# EAGLE design FAN-zero25-SHIM (EAGLE 9.6.2)
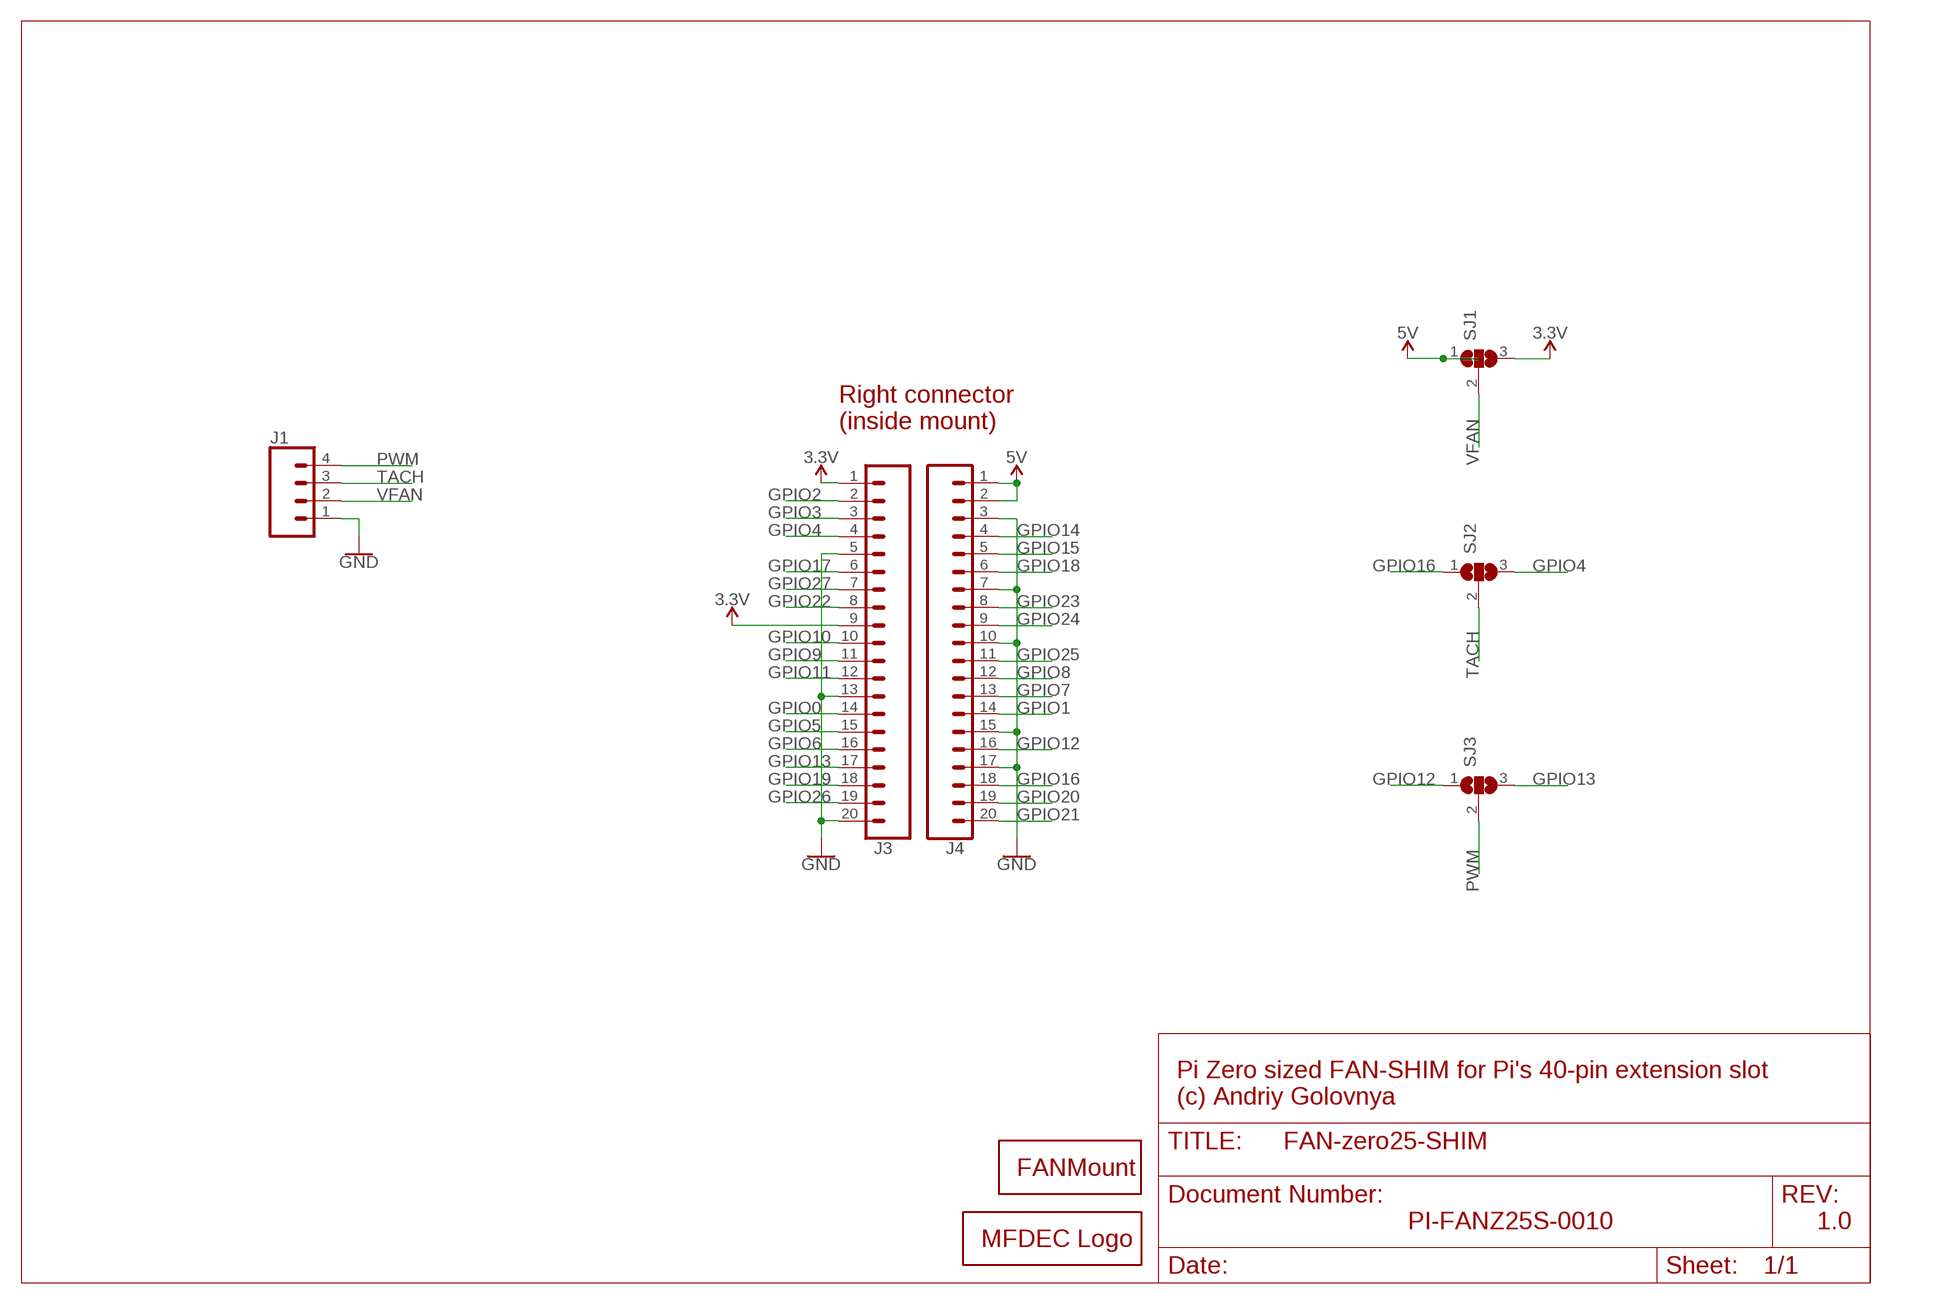
[diagram p0: schematic, sheet 1]

## Parts
FAN1  FAN25HO  [FAN25HO]
J1  CONN_04  [1X04]
J3  CONN_20LOCK  [1X20_LOCK]
J4  CONN_20LOCK  [1X20_LOCK]
LOGO1  MFDECLOGO_L_30MM  [MFDEC_L_30MM]
SJ1  SJ2  [SJ_2]
SJ2  SJ2  [SJ_2]
SJ3  SJ2  [SJ_2]

## Nets
3.3V: J3.1 J3.9 SJ1.3
5V: J4.1 J4.2 SJ1.1
GND: J1.1 J3.5 J3.13 J3.20 J4.3 J4.7 J4.10 J4.15 J4.17
GPIO0: J3.14
GPIO1: J4.14
GPIO2: J3.2
GPIO3: J3.3
GPIO4: J3.4 SJ2.3
GPIO5: J3.15
GPIO6: J3.16
GPIO7: J4.13
GPIO8: J4.12
GPIO9: J3.11
GPIO10: J3.10
GPIO11: J3.12
GPIO12: J4.16 SJ3.1
GPIO13: J3.17 SJ3.3
GPIO14: J4.4
GPIO15: J4.5
GPIO16: J4.18 SJ2.1
GPIO17: J3.6
GPIO18: J4.6
GPIO19: J3.18
GPIO20: J4.19
GPIO21: J4.20
GPIO22: J3.8
GPIO23: J4.8
GPIO24: J4.9
GPIO25: J4.11
GPIO26: J3.19
GPIO27: J3.7
PWM: J1.4 SJ3.2
TACH: J1.3 SJ2.2
VFAN: J1.2 SJ1.2

## Notes on the sheet
- Right connector
  (inside mount)
- Pi Zero sized FAN-SHIM for Pi's 40-pin extension slot
  (c) Andriy Golovnya
- PI-FANZ25S-0010 | 1.0

## Library data of the parts
FAN1 = _my_fans:FAN: Fan mount holes: 17mm 20mm 25mm 30mm 40mm 50mm 60mm
J1 = SparkFun-Connectors:CONN_04: Multi connection point. Often used as Generic Header-pin footprint for 0.1 inch spaced/style header connections On any of the 0.1 inch spaced packages, you can populate with these: Break Away Headers - Straight <https://www.sparkfun.com/products/116> (PRT-00116) Break Away Male Headers - Right Angle <https://www.sparkfun.com/products/553> (PRT-00553) Female Headers <https://www.sparkfun.com/products/115> (PRT-00115) Break Away Headers - Machine Pin <https://www.sparkfun.com/products/117> (PRT-00117) Break Away Female Headers - Swiss Machine Pin <https://www.sparkfun.com/products/743> (PRT-00743) For SCREWTERMINALS and SPRING TERMINALS visit here: Screw Terimnals on SparkFun.com <https://www.sparkfun.com/search/results?term=Screw+Terminals> (5mm/3.5mm/2.54mm spacing) This device is also useful as a general connection point to wire up your design to another part of your project. Our various solder wires solder well into these plated through hole pads. Hook-Up Wire - Assortment (Stranded, 22 AWG) <https://www.sparkfun.com/products/11375> (PRT-11375) Hook-Up Wire - Assortment (Solid Core, 22 AWG) <https://www.sparkfun.com/products/11367> (PRT-11367) View the entire wire category on our website here <https://www.sparkfun.com/categories/141> Special notes: Molex polarized connector foot print use with SKU : PRT-08231 with associated crimp pins and housings. 1MM SMD Version SKU: PRT-10208; PROD_ID: CONN-09696
J3 J4 = _my_locked_connectors:CONN_20: Multi connection point. Often used as Generic Header-pin footprint for 0.1 inch spaced/style header connections On any of the 0.1 inch spaced packages, you can populate with these: Break Away Headers - Straight <https://www.sparkfun.com/products/116> (PRT-00116) Break Away Male Headers - Right Angle <https://www.sparkfun.com/products/553> (PRT-00553) Female Headers <https://www.sparkfun.com/products/115> (PRT-00115) Break Away Headers - Machine Pin <https://www.sparkfun.com/products/117> (PRT-00117) Break Away Female Headers - Swiss Machine Pin <https://www.sparkfun.com/products/743> (PRT-00743) For SCREWTERMINALS and SPRING TERMINALS visit here: Screw Terimnals on SparkFun.com <https://www.sparkfun.com/search/results?term=Screw+Terminals> (5mm/3.5mm/2.54mm spacing) This device is also useful as a general connection point to wire up your design to another part of your project. Our various solder wires solder well into these plated through hole pads. Hook-Up Wire - Assortment (Stranded, 22 AWG) <https://www.sparkfun.com/products/11375> (PRT-11375) Hook-Up Wire - Assortment (Solid Core, 22 AWG) <https://www.sparkfun.com/products/11367> (PRT-11367) View the entire wire category on our website here <https://www.sparkfun.com/categories/141> Special notes: Molex polarized connector foot print use with SKU : PRT-08231 with associated crimp pins and housings. 1MM SMD Version SKU: PRT-10208 NOTES ON THE VARIANTS LOCK and LOCK_LONGPADS... This footprint was designed to help hold the alignment of a through-hole component (i.e. 6-pin header) while soldering it into place. You may notice that each hole has been shifted either up or down by 0.005 of an inch from it's more standard position (which is a perfectly straight line). This slight alteration caused the pins (the squares in the middle) to touch the edges of the holes. Because they are alternating, it causes a "brace" to hold the component in place. 0.005 has proven to be the perfect amount of "off-center" position when using our standard breakaway headers. Although looks a little odd when you look at the bare footprint, once you have a header in there, the alteration is very hard to notice. Also,if you push a header all the way into place, it is covered up entirely on the bottom side. Note about LOCK SPECIAL package: This is just like the LOCK variant in that the holes are staggared by 5 mil, but except for the last two holes. They are not altered from the "standard" footprint layout. This is used for a special purpose on the layout of our Graphic LCD Backpack. Make sure you want to use this device before selecting it for you project!
LOGO1 = _my_logos:MFDECLOGO: Midnight Fog - Digital Eye Candy LOGO
SJ1-SJ3 = _my_jumpers:SJ2: SMD solder JUMPER SJ2 - simple jumper SJ2FI - fancy inside jumper SJ2FO - fancy outside jumper SJ2FL - fancy left jumper SJ2FR - fancy right jumper SJ2W - wide jumper

## Board
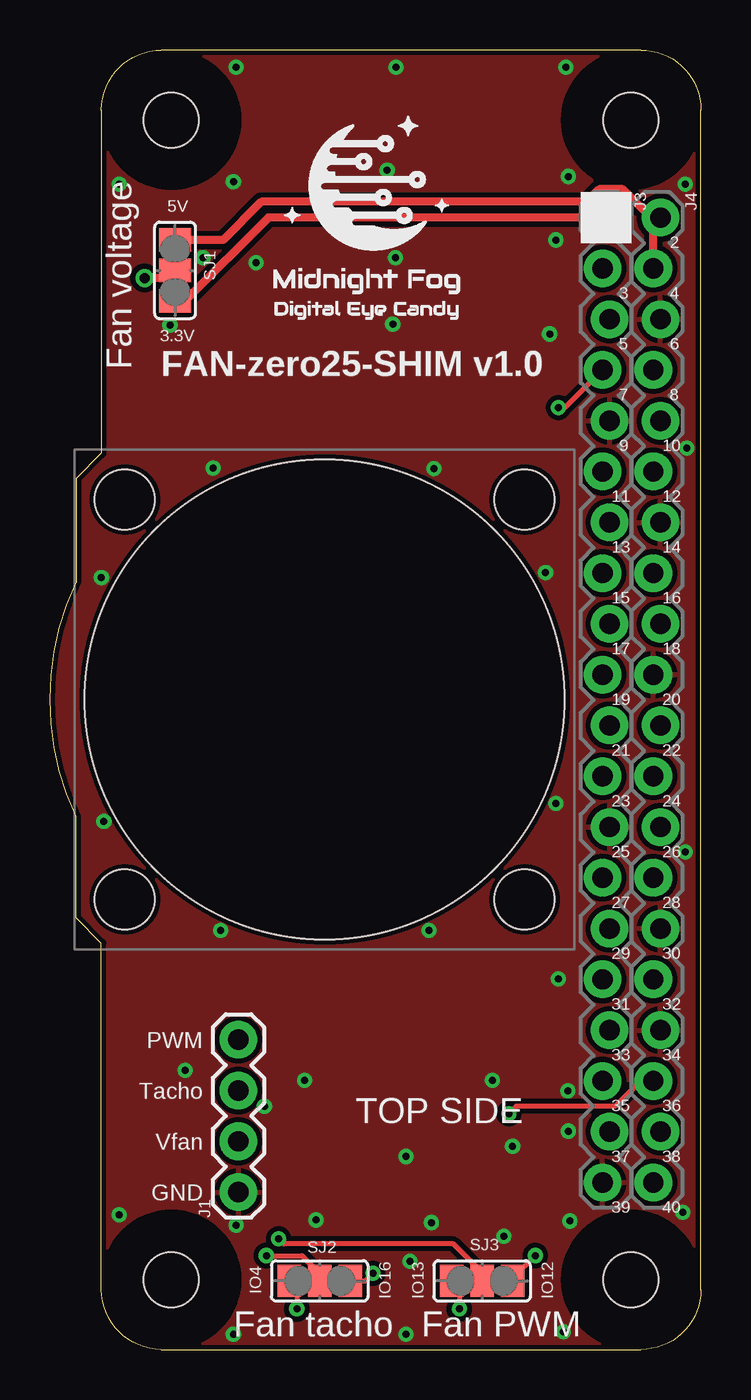
[diagram p1: board, top side]
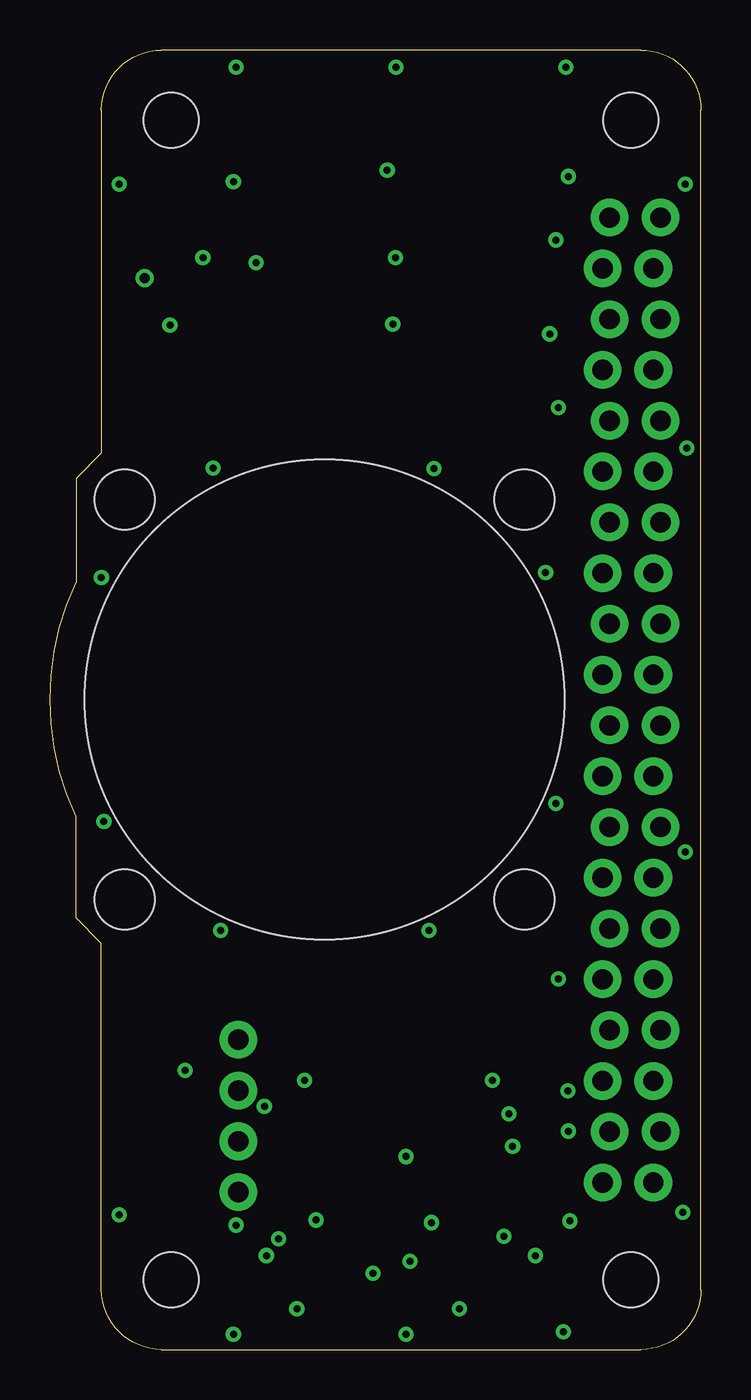
[diagram p2: board, inner layer Route2]
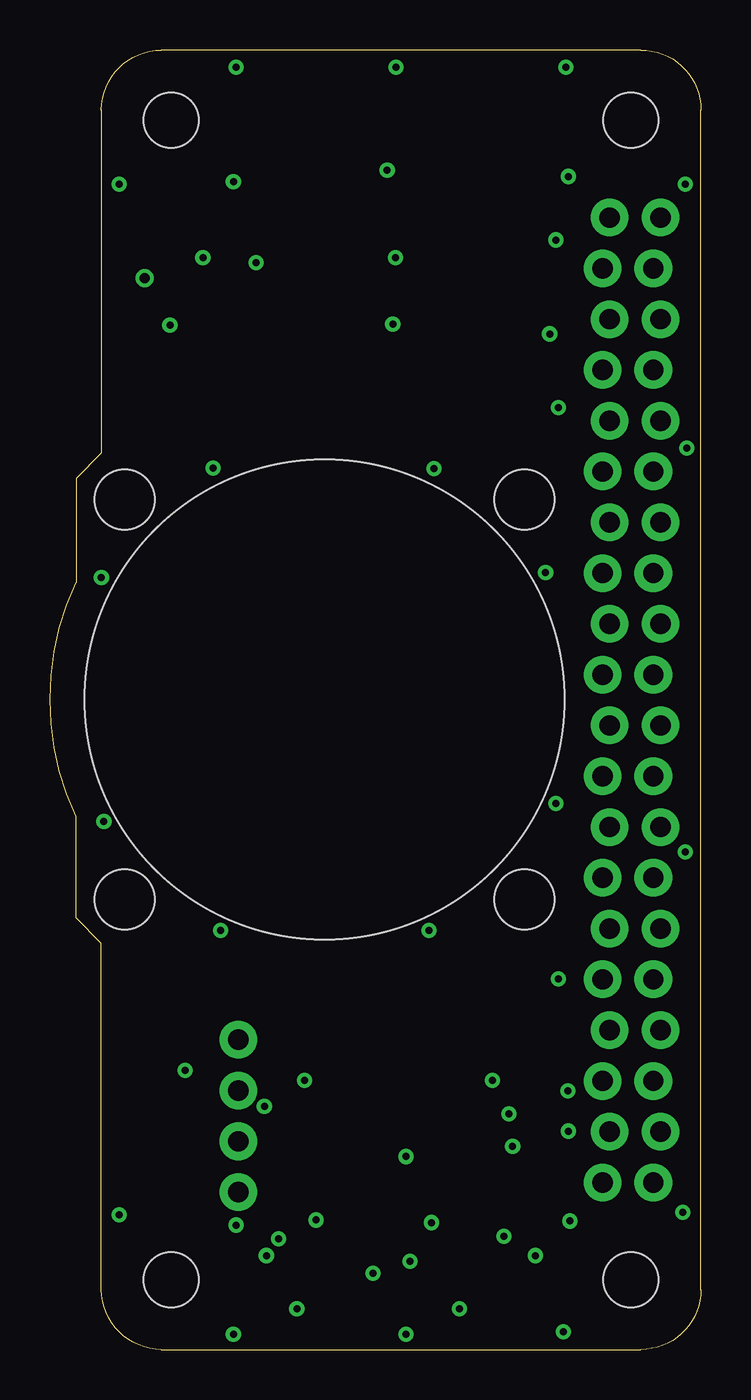
[diagram p3: board, inner layer Route15]
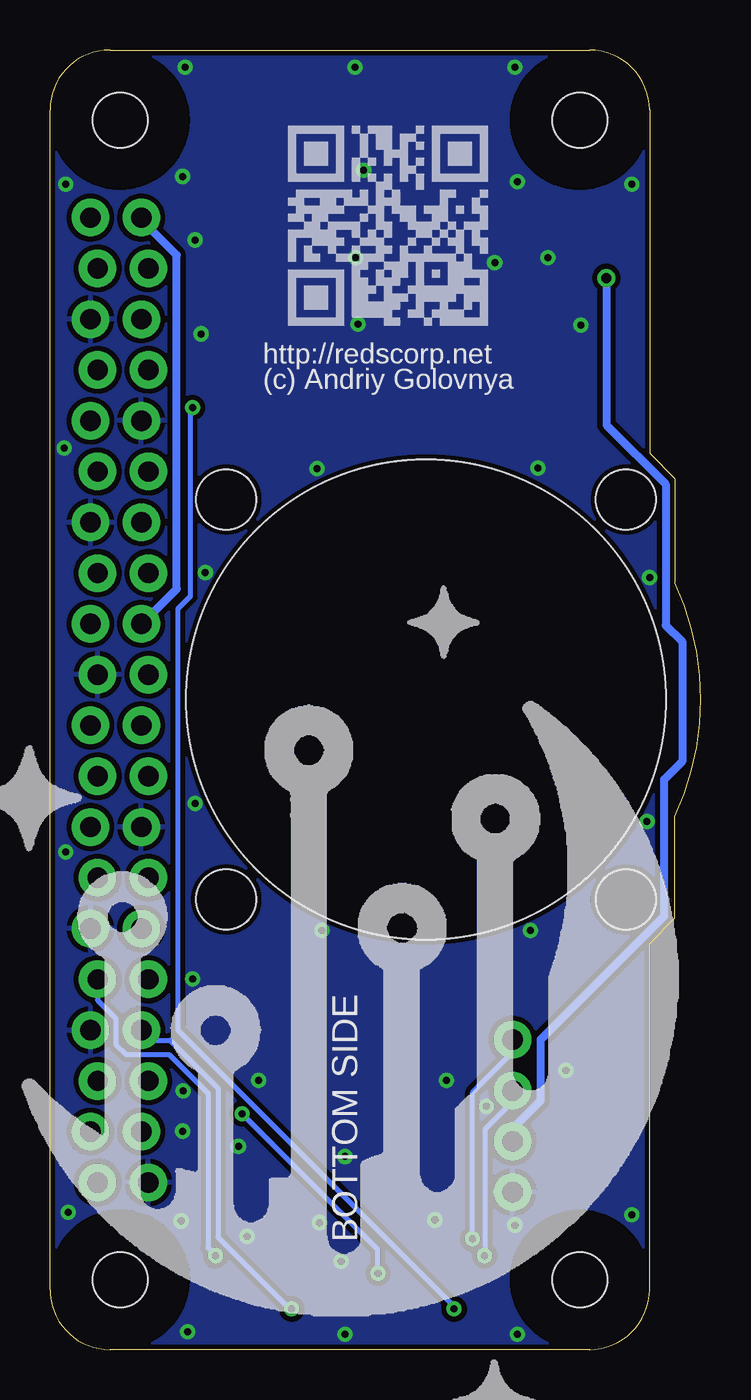
[diagram p4: board, bottom side, seen from below]

Size 32.57 x 65 mm. Coordinates in mm from the lower left corner, seen from the top.
Outline: 2.57,3 arc90 5.57,0 29.57,0 arc90 32.57,3 32.57,62 arc90 29.57,65 5.57,65 arc90 2.57,62
Outline: 2.57,3 arc0 2.57,3
Outline: 2.57,62 arc0 2.57,62
Outline: 2.57,3 2.57,20.32 1.3,21.59 1.3,26.67 arc-50 1.3,38.35 1.3,43.56 2.57,44.83 2.57,62
Copper layers (1*16): Top 0.035mm / dielectric 1.5mm / Bottom 0.035mm
Design rules "default *": minimum track width 6mil, minimum drill 0.35mm, track to track 6mil, track to pad 6mil, pad to pad 6mil, via to via 6mil, smd to smd 6mil, copper to edge 6mil, drill to drill 6mil, minimum pad ring 10mil, minimum via ring 8mil, stop-mask expansion 4mil, vias tented up to drill 20mil, thermal gap 10mil
Holes 2.75 mm at 6.07,3.5 29.07,3.5 6.07,61.5 29.07,61.5

### Footprints (pad centres in the part's own frame; a part is rotated, then mirrored left to right if it is on the bottom)
FAN25HO = hole 3: -10,10; 10,10; -10,-10; 10,-10 | hole 24: 0,0
1X04 = drill 1.016 pad 1.88: 1 0,0; 2 2.54,0; 3 5.08,0; 4 7.62,0
1X20_LOCK = drill 1.016 pad 1.88: 1 0,0.178; 2 2.54,-0.178; 3 5.08,0.178; 4 7.62,-0.178; 5 10.16,0.178; 6 12.7,-0.178; 7 15.24,0.178; 8 17.78,-0.178; 9 20.32,0.178; 10 22.86,-0.178; 11 25.4,0.178; 12 27.94,-0.178; 13 30.48,0.178; 14 33.02,-0.178; 15 35.56,0.178; 16 38.1,-0.178; 17 40.64,0.178; 18 43.18,-0.178; 19 45.72,0.178; 20 48.26,-0.178
SJ_2 = smd 1.168 x 1.6: 1 -1.524,0; 2 0,0; 3 1.524,0

### Placement (x,y rotation side)
FAN1  13.75,32.51 0 top
J1  9.43,7.87 90 top
J3  27.83,56.62 270 top
J4  30.37,56.62 270 top
LOGO1  -1.62,-7.11 90 bottom  (outside the outline)
LOGO2  MFDECLOGO_SQ_8MM  [MFDEC_SQ_8MM]  10.5,51.21 0 top
LOGO3  RSNURL_QR_10MM  [RSNURL_QR_10MM]  20.66,51.21 0 bottom
SJ1  6.26,53.98 270 top
SJ2  13.49,3.43 180 top
SJ3  21.62,3.43 180 top

### Tracks (layer width: path | path; a pad name or v marks a point on that pad's centre or on a via)
3.3V
  Top 0.406: J3.1 10.93,56.62 6.76,52.45 SJ1.3
  Bottom 0.406: J3.1 28,56.52 26.23,54.74 26.23,38.04 27.98,36.3 J3.9
5V
  Top 0.406: J4.2 30.19,56.26 J4.1 30.09,56.62 28.67,58.04 27.47,58.04 26.83,57.4 10.57,57.4 8.67,55.5 SJ1.1
GND  (via drill 0.35)
  other vias: 25.69,0.89 31.66,6.86 9.18,0.76 3.46,6.73 9.3,6.22 13.32,6.48 18.02,4.42 23.15,10.16 19.08,6.35 12.73,13.46 17.81,9.65 8.54,20.95 18.96,20.95 25.31,27.3 25.43,18.54 22.13,13.46 6.76,13.97 3.46,58.29 9.3,64.14 25.81,64.14 31.78,58.29 17.3,64.14 25.94,58.67 25.31,55.5 7.65,54.61 9.18,58.42 10.32,54.36 24.8,38.86 19.21,44.07 8.16,44.09 31.86,45.09 31.78,24.89 10.73,12.17 17.81,0.76 25.92,12.93 25.94,10.92 16.87,58.98 17.28,54.61 25,50.8 17.15,51.28 6,51.23 22.72,5.66 26.02,6.43 2.57,38.61 2.7,26.42
  pour Top (isolate 0.254): -6.32,0 -6.32,65.15 32.8,65.15 32.8,0
  pour Bottom (isolate 0.254): -6.32,0 -6.32,65.15 32.8,65.15 32.8,0
GND1
  cutout Top: 29.07,0 arc-180 29.07,7 arc-180
  cutout Route2: 29.07,0 arc-180 29.07,7 arc-180
  cutout Route15: 29.07,0 arc-180 29.07,7 arc-180
  cutout Bottom: 29.07,0 arc-180 29.07,7 arc-180
GND2
  cutout Top: 6.07,58 arc-180 6.07,65 arc-180
  cutout Route2: 6.07,58 arc-180 6.07,65 arc-180
  cutout Route15: 6.07,58 arc-180 6.07,65 arc-180
  cutout Bottom: 6.07,58 arc-180 6.07,65 arc-180
GND3
  cutout Top: 29.07,58 arc-180 29.07,65 arc-180
  cutout Route2: 29.07,58 arc-180 29.07,65 arc-180
  cutout Route15: 29.07,58 arc-180 29.07,65 arc-180
  cutout Bottom: 29.07,58 arc-180 29.07,65 arc-180
GND4
  cutout Top: 6.07,0 arc-180 6.07,7 arc-180
  cutout Route2: 6.07,0 arc-180 6.07,7 arc-180
  cutout Route15: 6.07,0 arc-180 6.07,7 arc-180
  cutout Bottom: 6.07,0 arc-180 6.07,7 arc-180
GPIO4  (via drill 0.35)
  Top 0.254: J3.4 25.77,47.12 v25.43,47.12 | v12.35,2.03 12.35,3.05 SJ2.3
  Bottom 0.254: v25.43,47.12 25.56,46.99 25.56,37.66 26.18,37.05 26.18,15.98 12.35,2.16 v12.35,2.03
GPIO12  (via drill 0.35)
  Top 0.254: SJ3.1 23.15,3.56 v24.29,4.7
  Bottom 0.254: J4.16 30.19,17.47 29.27,16.56 29.27,15.27 28.76,14.76 26.61,14.76 24.67,12.82 24.67,5.08 v24.29,4.7
GPIO13  (via drill 0.35)
  Top 0.254: SJ3.3 20.48,3.05 v20.48,2.03
  Bottom 0.254: J3.17 27.5,15.47 26.56,15.47 24.16,13.07 24.16,5.61 20.58,2.03 v20.48,2.03
GPIO16  (via drill 0.35)
  Top 0.254: J4.18 29.55,13.44 28.28,12.16 23.33,12.16 v22.96,11.79 | v16.16,3.81 15.78,3.43 SJ2.1
  Bottom 0.254: v22.96,11.79 16.16,5 v16.16,3.81
PWM  (via drill 0.35)
  Top 0.254: SJ3.2 21.62,3.85 20.2,5.28 11.69,5.28 v11.43,5.53
  Bottom 0.254: v11.43,5.53 11.43,12.86 9.43,14.86 J1.4
TACH  (via drill 0.35)
  Top 0.254: SJ2.2 13.11,3.81 13.11,4.19 12.61,4.7 v10.83,4.7
  Bottom 0.254: v10.83,4.7 10.78,4.75 10.78,11.05 9.43,12.39 J1.3
VFAN  (via drill 0.5)
  Top 0.152: SJ1.2 6.26,55.07
  Top 0.406: SJ1.2 5.87,53.59 v4.73,53.59
  Bottom 0.406: v4.73,53.59 4.73,46.25 1.77,43.28 1.77,36.23 0.92,35.38 0.92,29.44 1.85,28.52 1.85,21.68 8.03,15.49 8.03,12.45 9.43,11.05 J1.2

### Text on the board
tPlace: 5V | 2 | 3 | 4 | 3.3V | 5 | 6 | Fan voltage | FAN-zero25-SHIM v1.0 | 7 | 8 | 9 | 10 | 11 | 12 | 13 | 14 | 15 | 16 | 17 | 18 | 19 | 20 | 21 | 22 | 23 | 24 | 25 | 26 | 27 | 28 | 29 | 30 | 31 | 32 | PWM | 33 | 34 | Tacho | 35 | 36 | Vfan | TOP SIDE | 37 | 38 | GND | 39 | 40 | IO4 | IO16 | IO13 | IO12 | Fan tacho | Fan PWM
bPlace: http://redscorp.net | (c) Andriy Golovnya | BOTTOM SIDE